# Altium schematic sheet DASHCAM CPU_V2.0B - Top Level.SchDoc: Top Level
size A2; DrawnBy: UKAYACIK; Engineer: UKAYACIK; DocumentNumber: 2; Revision: B; SheetNumber: 2; SheetTotal: 21; Sheet Title: Top Level; Version: 1.0
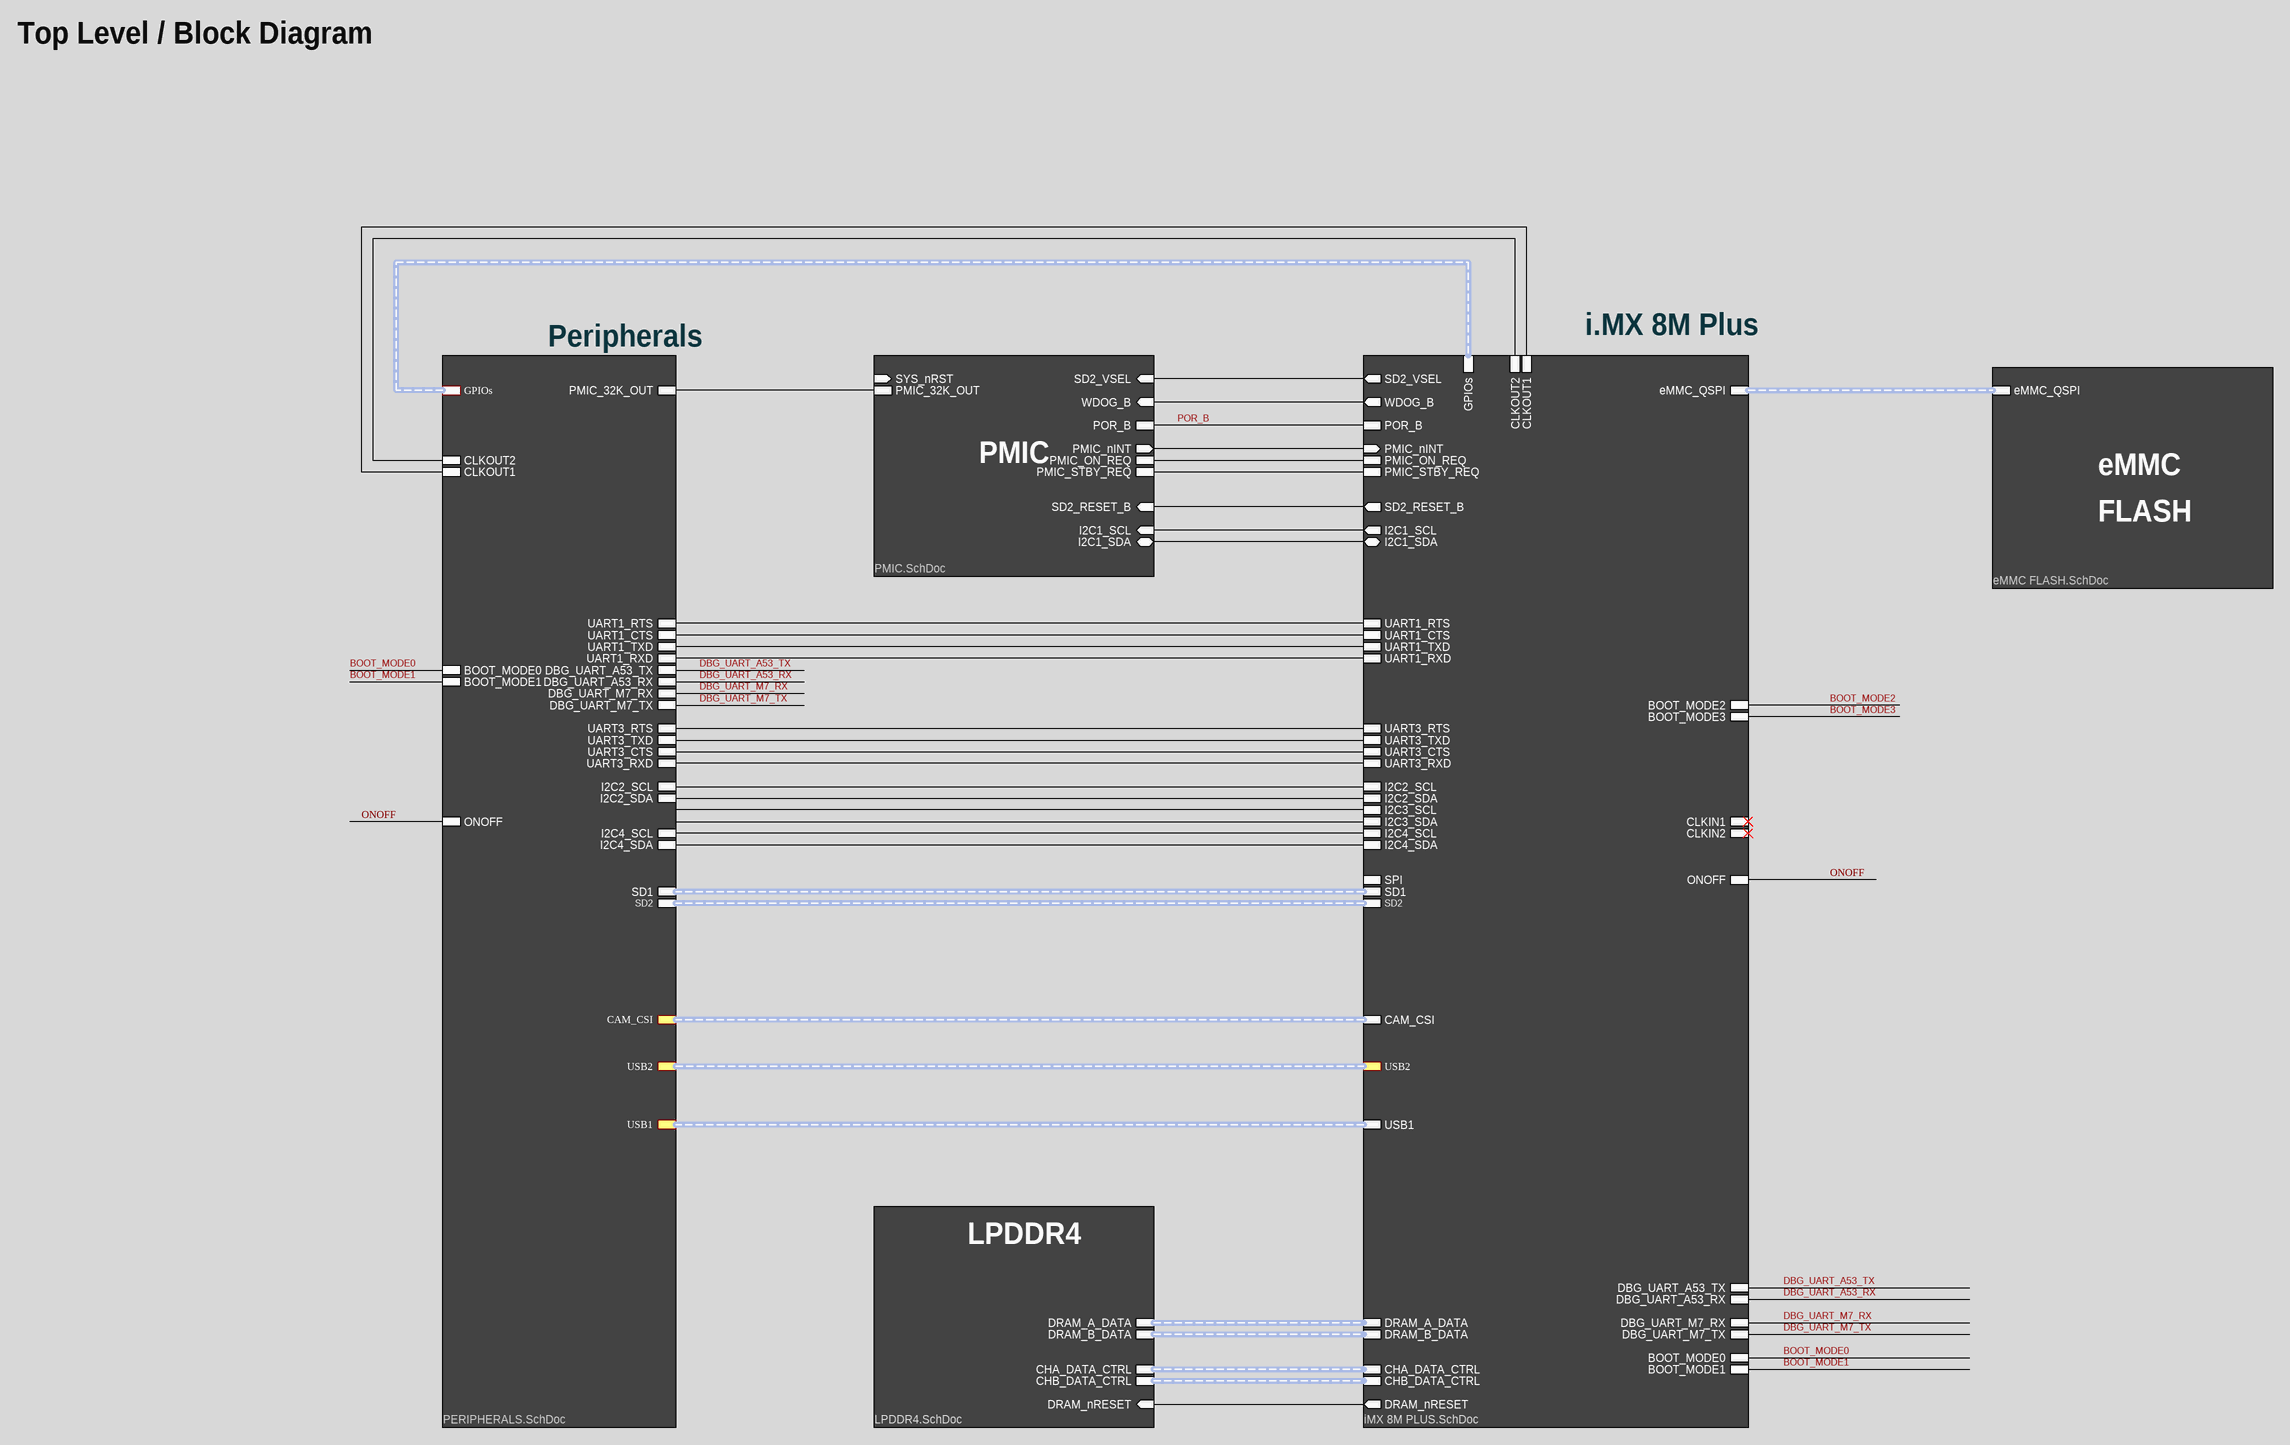
[diagram p0: DASHCAM CPU_V2.0B - Top Level.SchDoc]

## Sub-sheets
A = iMX 8M PLUS.SchDoc: DRAM_A_DATA (harness DRAM_A), DRAM_B_DATA (harness DRAM_A), CHA_DATA_CTRL (harness DRAM_A), CHB_DATA_CTRL (harness DRAM_A), DRAM_nRESET (out), DBG_UART_A53_TX, DBG_UART_A53_RX, DBG_UART_M7_RX, DBG_UART_M7_TX, BOOT_MODE0, BOOT_MODE1, USB1 (harness DRAM_A), eMMC_QSPI (harness DRAM_A), I2C1_SCL (out), I2C1_SDA (bidir), PMIC_nINT (in), SD2_VSEL (out), WDOG_B (out), SD2_RESET_B (out), ONOFF, POR_B, PMIC_ON_REQ, PMIC_STBY_REQ, UART1_RTS, UART1_CTS, UART1_TXD, UART1_RXD, I2C2_SCL, I2C2_SDA, I2C3_SCL, I2C3_SDA, I2C4_SCL, I2C4_SDA, UART3_RTS, UART3_TXD, UART3_CTS, UART3_RXD, BOOT_MODE2, BOOT_MODE3, CLKIN1, CLKIN2, CLKOUT1, CLKOUT2, CAM_CSI (harness DRAM_A), GPIOs (harness DRAM_A), SPI (harness DRAM_A), SD1 (harness DRAM_A), SD2 (harness DRAM_A), USB2 (harness DRAM_A)
B = PERIPHERALS.SchDoc: PMIC_32K_OUT, DBG_UART_A53_TX, DBG_UART_A53_RX, DBG_UART_M7_RX, DBG_UART_M7_TX, UART1_RTS, UART1_CTS, UART1_TXD, UART1_RXD, I2C2_SCL, I2C2_SDA, I2C4_SCL, I2C4_SDA, UART3_RTS, UART3_TXD, UART3_CTS, UART3_RXD, SD1 (harness SD1), SD2 (harness SD2), USB1 (harness USB1), CAM_CSI (harness CAM_CSI), GPIOs (harness GPIOs), CLKOUT1, BOOT_MODE0, BOOT_MODE1, ONOFF, CLKOUT2, USB2 (harness USB2)
Q = PMIC.SchDoc: PMIC_ON_REQ, PMIC_STBY_REQ, WDOG_B (in), SYS_nRST (in), I2C1_SCL (in), I2C1_SDA (bidir), POR_B, PMIC_nINT (out), PMIC_32K_OUT, SD2_RESET_B (in), SD2_VSEL (in)
R = LPDDR4.SchDoc: DRAM_A_DATA (harness DRAM_A_DATA), CHA_DATA_CTRL (harness CHA_DATA_CTRL), DRAM_B_DATA (harness DRAM_B_DATA), CHB_DATA_CTRL (harness CHB_DATA_CTRL), DRAM_nRESET (in)
S = eMMC FLASH.SchDoc: eMMC_QSPI (harness eMMC_QSPI)

## Nets
BOOT_MODE0: sheet A/BOOT_MODE0, sheet B/BOOT_MODE0
BOOT_MODE1: sheet A/BOOT_MODE1, sheet B/BOOT_MODE1
BOOT_MODE2: sheet A/BOOT_MODE2
BOOT_MODE3: sheet A/BOOT_MODE3
DBG_UART_A53_RX: sheet A/DBG_UART_A53_RX, sheet B/DBG_UART_A53_RX
DBG_UART_A53_TX: sheet A/DBG_UART_A53_TX, sheet B/DBG_UART_A53_TX
DBG_UART_M7_RX: sheet A/DBG_UART_M7_RX, sheet B/DBG_UART_M7_RX
DBG_UART_M7_TX: sheet A/DBG_UART_M7_TX, sheet B/DBG_UART_M7_TX
ONOFF: sheet A/ONOFF, sheet B/ONOFF
POR_B: sheet A/POR_B, sheet Q/POR_B
(unnamed): sheet A/DRAM_nRESET, sheet R/DRAM_nRESET
(unnamed): sheet A/I2C1_SCL, sheet Q/I2C1_SCL
(unnamed): sheet A/I2C1_SDA, sheet Q/I2C1_SDA
(unnamed): sheet A/PMIC_nINT, sheet Q/PMIC_nINT
(unnamed): sheet A/SD2_VSEL, sheet Q/SD2_VSEL
(unnamed): sheet A/WDOG_B, sheet Q/WDOG_B
(unnamed): sheet A/SD2_RESET_B, sheet Q/SD2_RESET_B
(unnamed): sheet A/PMIC_ON_REQ, sheet Q/PMIC_ON_REQ
(unnamed): sheet A/PMIC_STBY_REQ, sheet Q/PMIC_STBY_REQ
(unnamed): sheet A/UART1_RTS, sheet B/UART1_RTS
(unnamed): sheet A/UART1_CTS, sheet B/UART1_CTS
(unnamed): sheet A/UART1_TXD, sheet B/UART1_TXD
(unnamed): sheet A/UART1_RXD, sheet B/UART1_RXD
(unnamed): sheet A/I2C2_SCL, sheet B/I2C2_SCL
(unnamed): sheet A/I2C2_SDA, sheet B/I2C2_SDA
(unnamed): sheet A/I2C4_SCL, sheet B/I2C4_SCL
(unnamed): sheet A/I2C4_SDA, sheet B/I2C4_SDA
(unnamed): sheet A/UART3_RTS, sheet B/UART3_RTS
(unnamed): sheet A/UART3_TXD, sheet B/UART3_TXD
(unnamed): sheet A/UART3_CTS, sheet B/UART3_CTS
(unnamed): sheet A/UART3_RXD, sheet B/UART3_RXD
(unnamed): sheet A/CLKOUT1, sheet B/CLKOUT1
(unnamed): sheet A/CLKOUT2, sheet B/CLKOUT2
(unnamed): sheet B/PMIC_32K_OUT, sheet Q/PMIC_32K_OUT

## Buses and harness runs
harness sheet A/CAM_CSI = sheet B/CAM_CSI
harness sheet A/CHA_DATA_CTRL = sheet R/CHA_DATA_CTRL
harness sheet A/CHB_DATA_CTRL = sheet R/CHB_DATA_CTRL
harness sheet A/DRAM_A_DATA = sheet R/DRAM_A_DATA
harness sheet A/DRAM_B_DATA = sheet R/DRAM_B_DATA
harness sheet A/eMMC_QSPI = sheet S/eMMC_QSPI
harness sheet A/GPIOs = sheet B/GPIOs
harness sheet A/SD1 = sheet B/SD1
harness sheet A/SD2 = sheet B/SD2
harness sheet A/USB1 = sheet B/USB1
harness sheet A/USB2 = sheet B/USB2

## Notes on the sheet
- Top Level / Block Diagram
- Peripherals
- i.MX 8M Plus
- PMIC
- eMMC
- FLASH
- LPDDR4
- PCB Des :
- Approv By :
- Project Title :
- Sheet Title :
- Date :
- Page :
- PCB Version :
- PCB Revision :
- Size :
- A2